# EAGLE schematic Hardware (EAGLE 8.6.3)
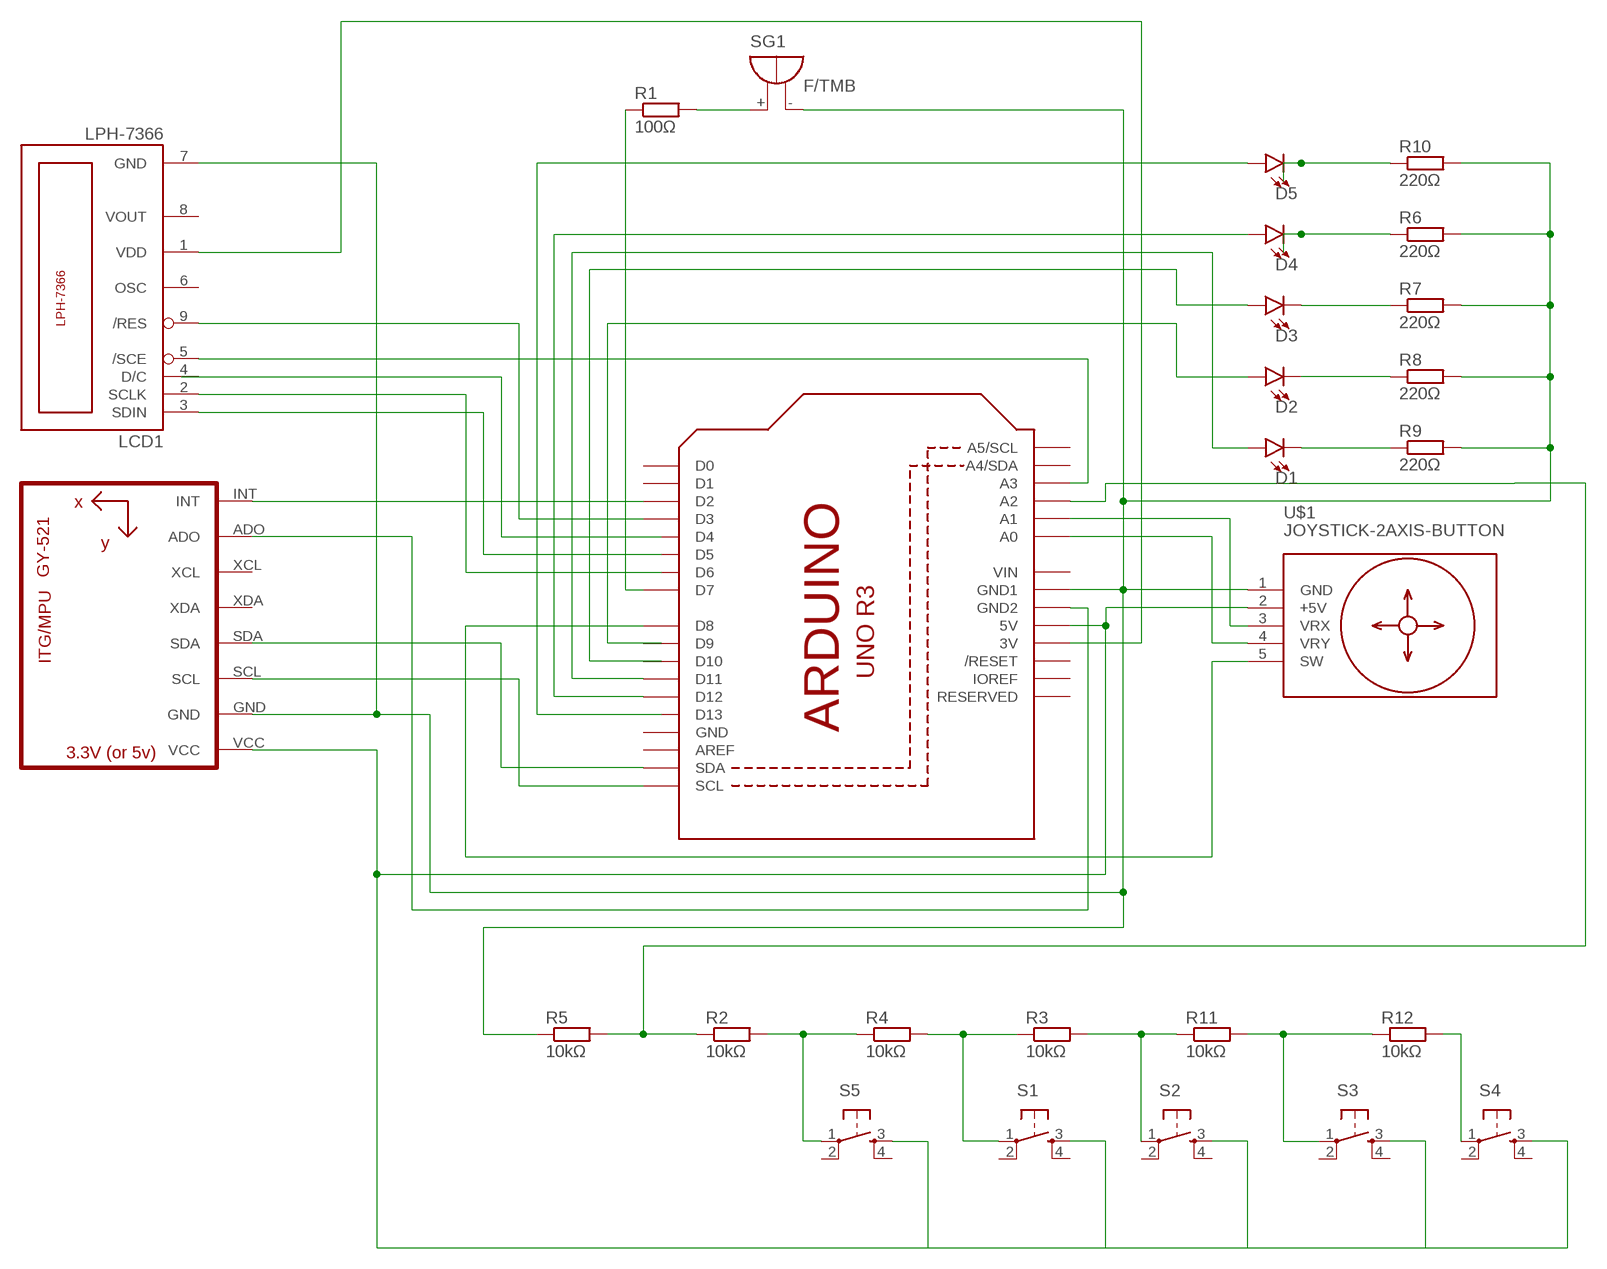
[diagram p0: schematic, sheet 1]

## Parts
D1  LED5MM  [LED_5MM]
D2  LED5MM  [LED_5MM]
D3  LED5MM  [LED_5MM]
D4  LED5MM  [LED_5MM]
D5  LED5MM  [LED_5MM]
LCD1  LPH-7366  [LPH-7366]
R1  100Ω  R-EU_0617/22  [0617/22]
R2  10kΩ  R-EU_0204/7  [0204/7]
R3  10kΩ  R-EU_0204/7  [0204/7]
R4  10kΩ  R-EU_0204/7  [0204/7]
R5  10kΩ  R-EU_0204/7  [0204/7]
R6  220Ω  R-EU_0204/7  [0204/7]
R7  220Ω  R-EU_0204/7  [0204/7]
R8  220Ω  R-EU_0204/7  [0204/7]
R9  220Ω  R-EU_0204/7  [0204/7]
R10  220Ω  R-EU_0204/7  [0204/7]
R11  10kΩ  R-EU_0204/7  [0204/7]
R12  10kΩ  R-EU_0204/7  [0204/7]
S1  TAC_SWITCHPTH  [TACTILE-PTH]
S2  TAC_SWITCHPTH  [TACTILE-PTH]
S3  TAC_SWITCHPTH  [TACTILE-PTH]
S4  TAC_SWITCHPTH  [TACTILE-PTH]
S5  TAC_SWITCHPTH  [TACTILE-PTH]
SG1  F/TMB  [F/TMB]
U1  GY-521MPU6050  [GY-521]
U2  ARDUINOR3-DIMENSION  [ARDUINOR3]
U$1  JOYSTICK-2AXIS-BUTTON  [JOYSTICK-2AXIS-BUTTON]

## Nets
N$1: R1.2 SG1.+
N$2: R1.1 U2.D7
N$3: U2.D8 U$1.5(SW)
N$4: D5.K(C) R10.1
N$5: U1.VCC U2.5V U$1.2(+5V)
N$6: U1.SCL
N$7: U2.A0 U$1.4(VRY)
N$8: U2.A1 U$1.3(VRX)
N$9: U1.SDA
N$10: U1.INT U2.D2
N$11: LCD1.5(/SCE) U2.A3
N$12: S1.3 S2.3 S3.3 S4.3 S5.3
N$13: R12.2 S4.1
N$14: D5.A
N$15: U1.ADO U2.GND2
N$16: R11.2 R12.1 S3.1
N$17: R3.2 R11.1 S2.1
N$18: LCD1.3(SDIN) U2.D5
N$19: R3.1 R4.2 S1.1
N$20: D1.K(C) R9.1
N$21: D2.K(C) R8.1
N$22: D3.K(C) R7.1
N$23: D4.K(C) R6.1
N$24: D2.A
N$25: D3.A
N$26: D1.A U2.D11
N$27: U2.D12
N$28: LCD1.7(GND) R5.1 R6.2 R7.2 R8.2 R9.2 R10.2 SG1.- U1.GND U2.GND1 U$1.1(GND)
N$29: R2.2 R4.1 S5.1
N$30: R2.1 R5.2 U2.A2
N$31: LCD1.1(VDD) U2.3V
N$32: LCD1.9(/RES) U2.D3
N$35: LCD1.2(SCLK)
Unconnected: D4.A LCD1.4(D/C) LCD1.6(OSC) LCD1.8(VOUT) S1.2 S1.4 S2.2 S2.4 S3.2 S3.4 S4.2 S4.4 S5.2 S5.4 U1.XCL U1.XDA U2.A4(A4/SDA) U2.A5(A5/SCL) U2.AREF U2.D0 U2.D1 U2.D4 U2.D6 U2.D9 U2.D10 U2.D13 U2.IOREF U2.RESERVED U2.RESET(/RESET) U2.SCL U2.SDA

## Power pins joined to a net without a drawn wire
GND: U2.GND
VIN: U2.VIN

## Library data of the parts
D1-D5 = SparkFun-LED:LED: LED (Generic) Standard schematic elements and footprints for 5mm, 3mm, 1206, and 0603 sized LEDs. Generic LEDs with no color specified.
LCD1 = lph-7366:LPH-7366
R1 = resistor:R-EU_: RESISTOR, European symbol
R2-R12 = rcl:R-EU_: RESISTOR, European symbol; SPICEPREFIX: R
S1-S5 = SparkFun-Retired:TAC_SWITCH: Momentary Switch Button commonly used for reset or general input. Spark Fun Electronics SKU : COM-00097 SMT- SWCH-08247
SG1 = buzzer:F/TMB: BUZZER Source: Buerklin; OC_FARNELL: unknown; OC_NEWARK: unknown
U1 = gy-521:GY-521
U2 = adafruit:ARDUINOR3: This is a new object for the new Arduino R3 - with extra pins that you may want to use (such as IOref, and duplicated A4/A5
U$1 = diy-modules:JOYSTICK-2AXIS-BUTTON: 2-Axis Analog Joystick with Push Button Tutorial is available here: http://henrysbench.capnfatz.com/henrys-bench/arduino-sensors-and-input/arduino-ps2-joystick-tutorial-keyes-ky-023-deek-robot/ Click here to find device on ebay.com <http://www.ebay.com/sch/joystick+ps2+module>